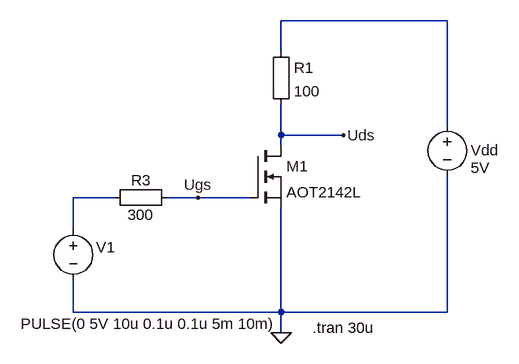
[diagram p0: schematic FET-switch-on.asc]
FET-switch-on.asc, the LTspice schematic file:
Version 4
SHEET 1 1292 680
WIRE -464 -288 -720 -288
WIRE -720 -240 -720 -288
WIRE -464 -128 -464 -288
WIRE -720 -112 -720 -160
WIRE -624 -112 -720 -112
WIRE -720 -96 -720 -112
WIRE -976 -16 -1040 -16
WIRE -848 -16 -896 -16
WIRE -768 -16 -848 -16
WIRE -1040 32 -1040 -16
WIRE -1040 160 -1040 112
WIRE -720 160 -720 0
WIRE -720 160 -1040 160
WIRE -464 160 -464 -48
WIRE -464 160 -720 160
WIRE -720 192 -720 160
FLAG -720 192 0
FLAG -624 -112 Uds
FLAG -848 -16 Ugs
SYMBOL voltage -464 -144 R0
WINDOW 123 0 0 Left 2
WINDOW 39 37 60 Left 2
WINDOW 0 36 55 Left 2
WINDOW 3 36 82 Left 2
SYMATTR InstName Vdd
SYMATTR Value 5V
SYMBOL voltage -1040 16 R0
WINDOW 123 0 0 Left 2
WINDOW 3 -81 162 Left 2
WINDOW 0 35 44 Left 2
WINDOW 39 -81 178 Left 2
SYMATTR Value PULSE(0 5V 10u 0.1u 0.1u 5m 10m)
SYMATTR InstName V1
SYMBOL nmos -768 -96 R0
SYMATTR InstName M1
SYMATTR Value AOT2142L
SYMBOL Misc\\EuropeanResistor -736 -256 R0
SYMATTR InstName R1
SYMATTR Value 100
SYMBOL Misc\\EuropeanResistor -880 -32 R90
WINDOW 0 5 56 VBottom 2
WINDOW 3 27 56 VTop 2
SYMATTR InstName R3
SYMATTR Value 300
TEXT -672 184 Left 2 !.tran 30u

The netlist it stands for:
* FET-switch-on.asc
Vdd N001 0 5V
V1 N002 0 PULSE(0 5V 10u 0.1u 0.1u 5m 10m)
M1 Uds Ugs 0 0 AOT2142L
R1 N001 Uds 100
R3 Ugs N002 300
.model NMOS NMOS
.model PMOS PMOS
.lib standard.mos
.tran 30u
.backanno
.end